# EAGLE board WiLoV2 (EAGLE 9.6.2)
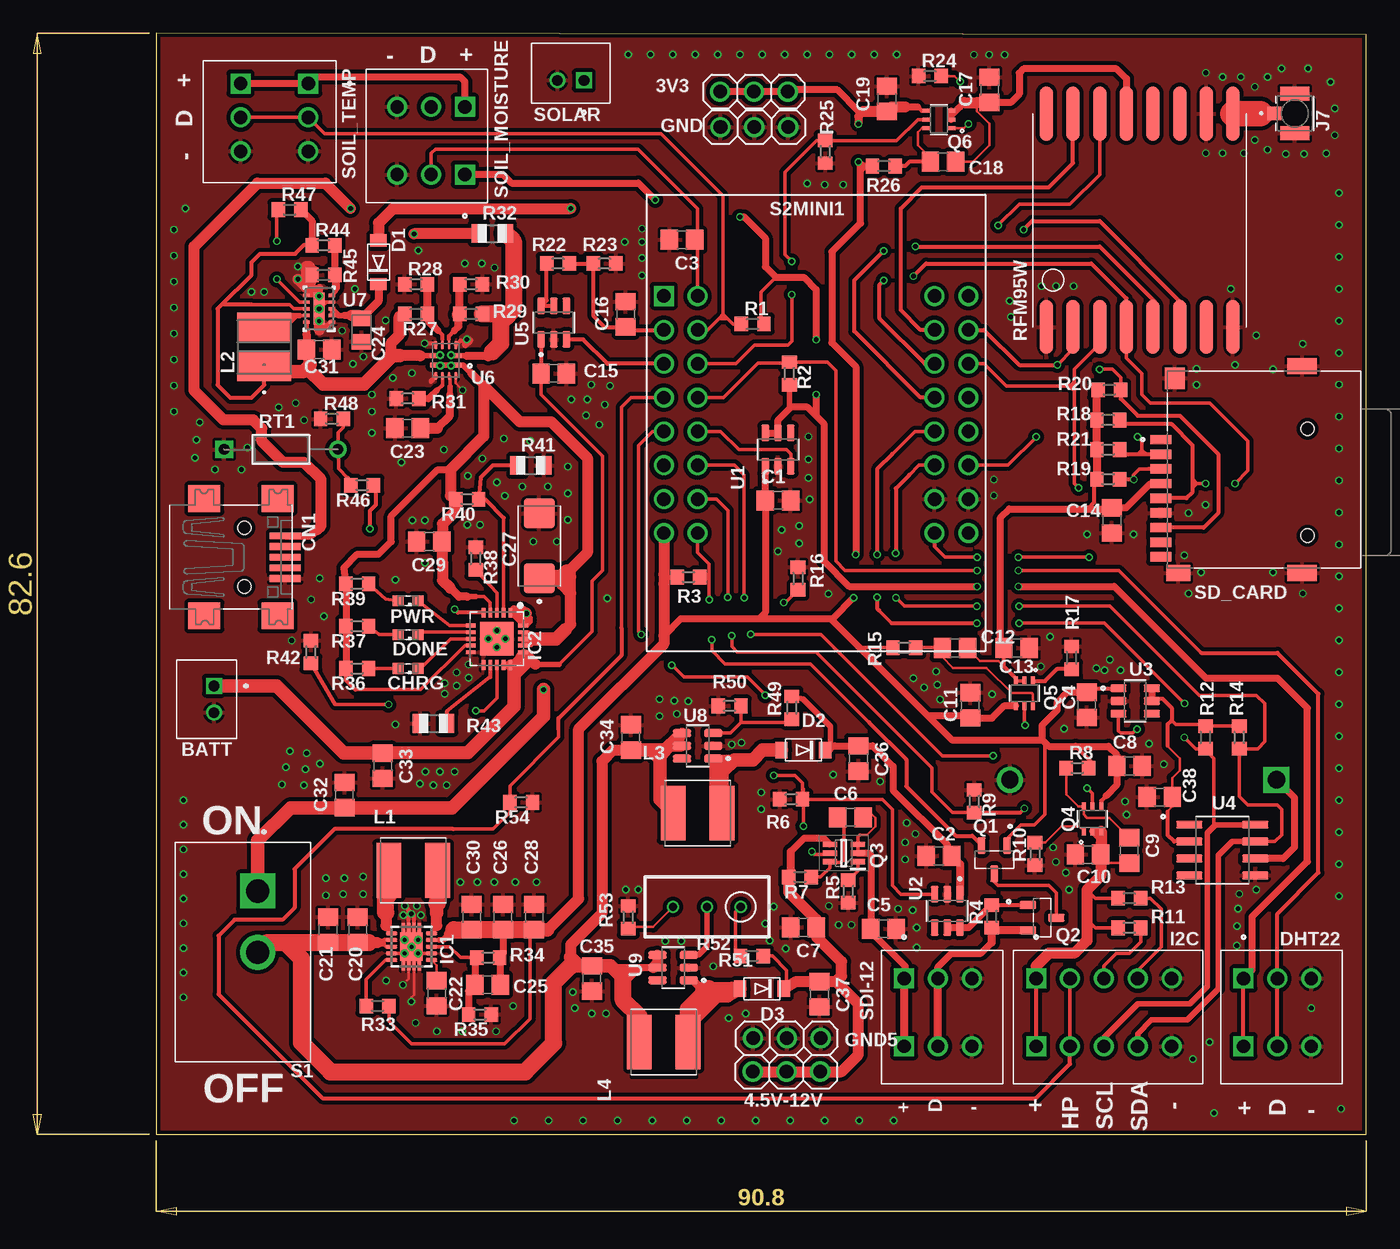
[diagram p3: board, top side]
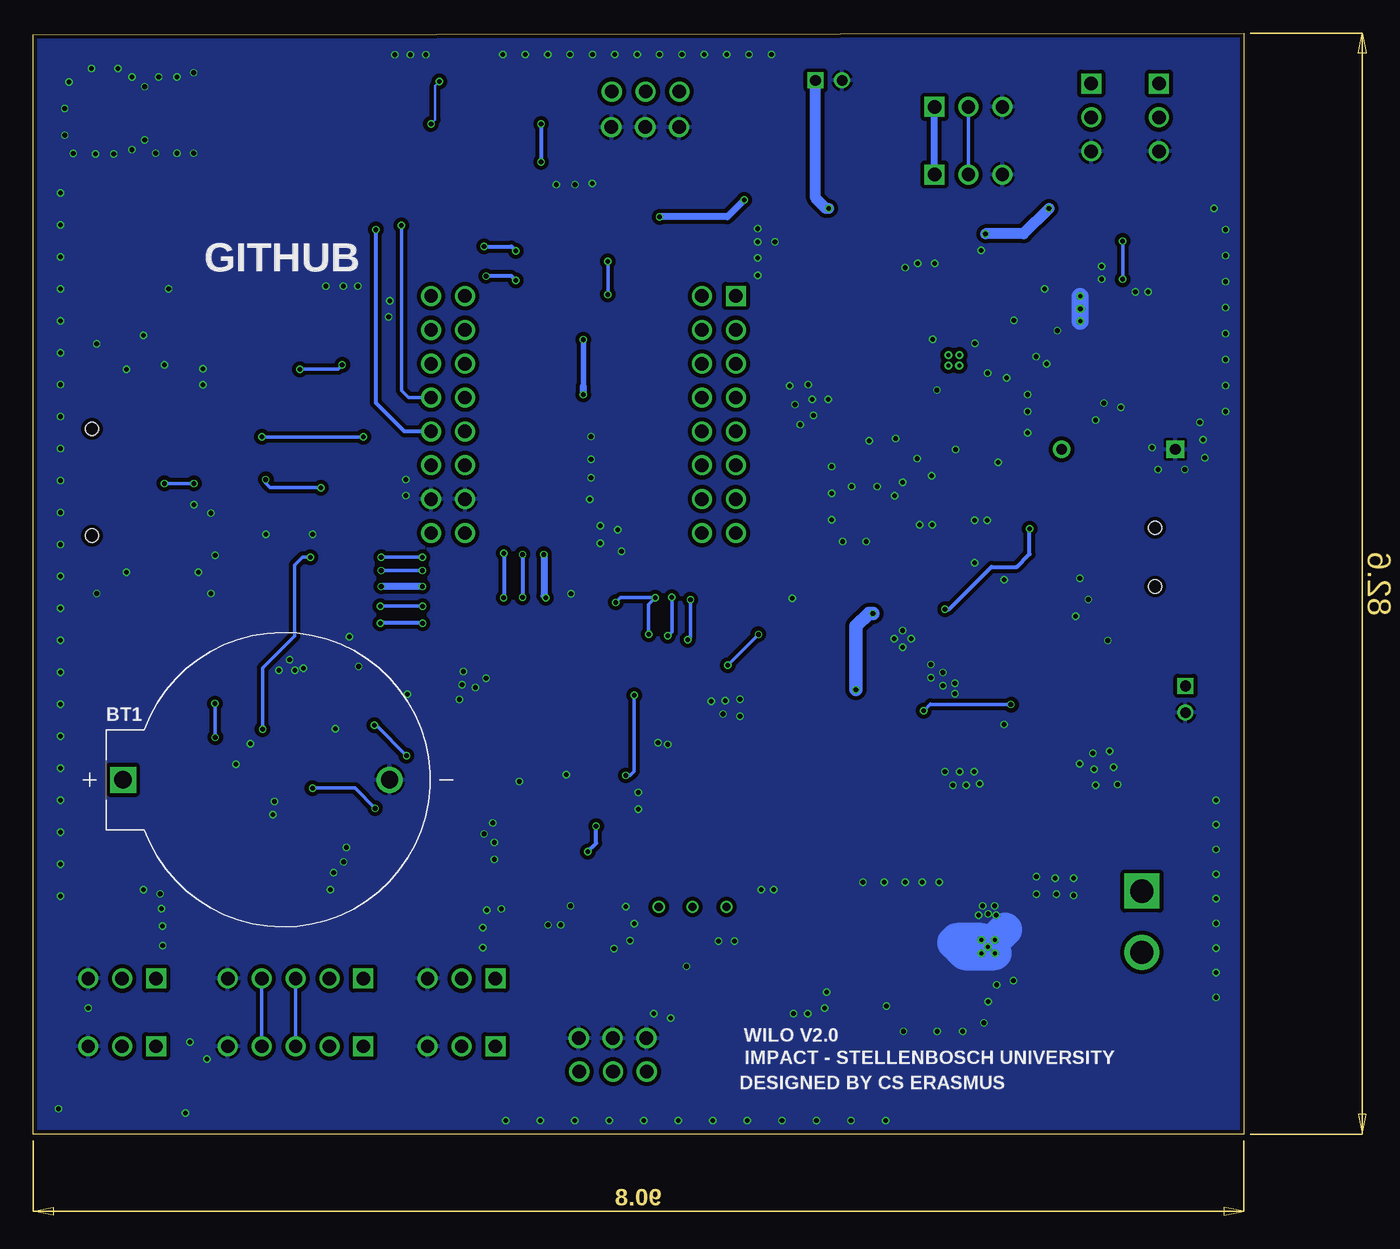
[diagram p4: board, bottom side, seen from below]

Size 90.8 x 82.6 mm. Coordinates in mm from the lower left corner, seen from the top.
Outline: 0,0 90.8,0 90.8,82.5 0,82.6 0,0
Copper layers (1*16): Top 0.035mm / dielectric 1.5mm / Bottom 0.035mm
Design rules "PCBWay_2L_152um-Track": minimum track width 6mil, minimum drill 0.3mm, track to track 6mil, track to pad 6mil, pad to pad 6mil, via to via 6mil, smd to smd 0mil, copper to edge 0.3mm, drill to drill 10mil, minimum pad ring 6mil, minimum via ring 0.1mm, stop-mask expansion 2mil, vias tented up to drill 0.45mm, thermal gap 0.2mm
Net classes: 0 default: width 0.203 mm; 1 vcc: width 0.254 mm; 2 Impedance: clearance 0.254 mm

## Footprints (pad centres in the part's own frame; a part is rotated, then mirrored left to right if it is on the bottom)
1X03 = drill 1.016: 1 -2.54,0; 2 0,0; 3 2.54,0
JST_B2B-PH-K-S = drill 0.8 square: 1 1,-0.55 | drill 0.8: 2 -1,-0.55
BAT_BH-25C-1 = drill 1.3: N -8,0 | drill 1.3 square: P 12,0
C0805 = smd 1.3 x 1.5: 1 -0.95,0; 2 0.95,0
CAPC2012X145N = smd 1.15 x 1.47: 1 -0.88,0; 2 0.88,0
CAPPM6032X280N = smd 2.24 x 2.32: 1 -2.435,0; 2 2.435,0
SML0603 = smd 0.8 x 0.8: A 0.75,0; C -0.75,0
USB-MINIB = smd 0.5 x 2.308: D+ 0,4.064; D- -0.8,4.064; GND 1.6,4.064; ID 0.8,4.064; VBUS -1.6,4.064 | smd 2 x 2.4: GND1 -4.4,-2; GND2 -4.4,3.5; GND3 4.4,3.5; GND4 4.4,-2 | hole 1: -2.2,1; 2.2,1
SOD-123FL = smd 0.91 x 1.22: A 1.637,0; C -1.637,0
CUI_TBL009V-254-03GY-2GY = drill 1 square: 1_A 0,0; 1_B 0,-5.08 | drill 1: 2_A 2.54,0; 2_B 2.54,-5.08; 3_A 5.08,0; 3_B 5.08,-5.08
CUI_TBL009V-254-05GY-2GY = drill 1 square: 1_A 0,0; 1_B 0,-5.08 | drill 1: 2_A 2.54,0; 2_B 2.54,-5.08; 3_A 5.08,0; 3_B 5.08,-5.08; 4_A 7.62,0; 4_B 7.62,-5.08; 5_A 10.16,0; 5_B 10.16,-5.08
DSC-S-PWSON-N10 = smd 0.28 x 0.85: 1 -1,-1.488; 2 -0.5,-1.488; 3 0,-1.488; 4 0.5,-1.488; 5 1,-1.488; 6 1,1.5; 7 0.5,1.5; 8 0,1.5; 9 -0.5,1.5; 10 -1,1.5 | smd 2.15 x 1.7: PP 0,0 | smd 3.55 x 0.25: PP@1 0,0.6; PP@2 0,0.2; PP@3 0,-0.2; PP@4 0,-0.6 | drill 0.3 pad 0.4: PP@5 -0.5,0.5; PP@7 0,0; PP@8 0.5,0.5; PP@9 -0.5,-0.5; PP@10 0.5,-0.5
QFN20_4MM = smd 0.73 x 0.28: P$1 -1.965,1; P$2 -1.965,0.5; P$3 -1.965,0; P$4 -1.965,-0.5; P$5 -1.965,-1; P$11 1.965,-1; P$12 1.965,-0.5; P$13 1.965,0; P$14 1.965,0.5; P$15 1.965,1 | smd 0.28 x 0.73: P$6 -1,-1.965; P$7 -0.5,-1.965; P$8 0,-1.965; P$9 0.5,-1.965; P$10 1,-1.965; P$16 1,1.965; P$17 0.5,1.965; P$18 0,1.965; P$19 -0.5,1.965; P$20 -1,1.965 | smd 2.5 x 2.5: P$21 0,0
HRS_U.FL-R-SMT(10) = smd 1.05 x 1: 1 -1.525,0 | smd 2.2 x 1.05: 2 0,1.475; 3 0,-1.475
IND_LQH5BPN1R0N38L = smd 1.85 x 4.1: 1 -1.825,0; 2 1.825,0
IND_IFSC_1515AH_VIS-M = smd 2.21 x 4.064: 1 -1.46,0; 2 1.46,0
IND_LQH5BPN6R8M38L = smd 1.85 x 4.1: 1 -1.825,0; 2 1.825,0
SOT95P240X111-3N = smd 1.23 x 0.6: 1 -1.06,0.95; 2 -1.06,-0.95; 3 1.06,0
SOT65P210X110-6N = smd 1.05 x 0.4: 1 -1.05,0.65; 2 -1.05,0; 3 -1.05,-0.65; 4 1.05,-0.65; 5 1.05,0; 6 1.05,0.65
TRANS_NTJD1155LT1G = smd 0.66 x 0.3: 1 -0.92,0.65; 2 -0.92,0; 3 -0.92,-0.65; 4 0.92,-0.65; 5 0.92,0; 6 0.92,0.65
R0603 = smd 1 x 1.1: 1 -0.85,0; 2 0.85,0
R0805 = smd 1.1 x 1.4: 1 -1,0; 2 1,0
RTRIM3296W = drill 0.61: 1 0,-2.54; 2 0,0; 3 0,2.54
HOPERF_RFM95W = smd 4.064 x 1.016: 1 -8.12,7.13; 2 -8.12,5.13; 3 -8.12,3.13; 4 -8.12,1.13; 5 -8.12,-0.87; 6 -8.12,-2.87; 7 -8.12,-4.87; 8 -8.12,-6.87; 9 7.88,-6.87; 10 7.88,-4.87; 11 7.88,-2.87; 12 7.88,-0.87; 13 7.88,1.13; 14 7.88,3.13; 15 7.88,5.13; 16 7.88,7.13
G1_USS = drill 0.813 pad 1.321 square: 1 0,0 | drill 0.813 pad 1.321: 2 8.534,0
SW_GF-123-0054 = drill 1.75 square: 1 -4.6,1.09 | drill 1.75: 2 0,1.09
S2MINI = drill 1: 1 3.81,-7.62; 2 3.81,-10.16; 3 1.27,-10.16; 3V3 1.27,-25.4; 4 3.81,-12.7; 5 1.27,-12.7; 6 3.81,-15.24; 7 1.27,-15.24; 8 3.81,-17.78; 9 1.27,-17.78; 10 3.81,-20.32; 11 1.27,-20.32; 12 1.27,-22.86; 13 3.81,-22.86; 14 3.81,-25.4; 15 21.59,-25.4; 16 24.13,-20.32; 17 21.59,-20.32; 18 24.13,-17.78; 21 21.59,-17.78; 33 24.13,-15.24; 34 21.59,-15.24; 35 24.13,-12.7; 36 21.59,-12.7; 37 24.13,-10.16; 38 21.59,-10.16; 39 24.13,-7.62; 40 21.59,-7.62; GND 21.59,-22.86; GND2 24.13,-22.86; VBUS 24.13,-25.4 | drill 1 square: EN 1.27,-7.62
CUI_MSD-4-A = smd 0.7 x 1.6: 1 2.25,7.75; 2 1.15,7.75; 3 0.05,7.75; 4 -1.05,7.75; 5 -2.15,7.75; 6 -3.25,7.75; 7 -4.35,7.75; 8 -5.45,7.75; CD -6.55,7.75 | smd 1.2 x 1.8: G1 -7.75,6.45 | smd 1.6 x 1.5: G2 6.85,6.7 | smd 1.2 x 2.2: G3 -7.75,-2.85; G4 7.75,-2.85 | hole 1: -4.95,-3.25; 3.05,-3.25
SOT95P280X145-6N = smd 1.21 x 0.58: 1 -1.255,0.95; 2 -1.255,0; 3 -1.255,-0.95; 4 1.255,-0.95; 5 1.255,0; 6 1.255,0.95
SOIC127P600X175-8N = smd 1.97 x 0.59: 1 -2.475,1.905; 2 -2.475,0.635; 3 -2.475,-0.635; 4 -2.475,-1.905; 5 2.475,-1.905; 6 2.475,-0.635; 7 2.475,0.635; 8 2.475,1.905
IC_TPS2121RUXR = smd 1.05 x 0.4: 1 -0.675,0.35; 2 -0.675,-0.35; 7 0.675,-0.35; 8 0.675,0.35 | drill 0.3 pad 0.406: 1_1 -0.402,0.384; 2_1 -0.402,-0.384; 7_1 0.41,-0.387; 8_1 0.404,0.38 | smd 0.2 x 0.6: 3 -0.75,-1.15; 4 -0.25,-1.15; 5 0.25,-1.15; 6 0.75,-1.15; 9 0.75,1.15; 10 0.25,1.15; 11 -0.25,1.15; 12 -0.75,1.15
DQC0010A = smd 0.5 x 0.25: 1 -0.95,1; 2 -0.95,0.5; 3 -0.95,0; 4 -0.95,-0.5; 5 -0.95,-1; 6 0.95,-1; 7 0.95,-0.5; 8 0.95,0; 9 0.95,0.5; 10 0.95,1 | smd 0.84 x 2.4: 11 0,0 | drill 0.3 pad 0.508: V 0,-0.94; V_2 0,0.94 | drill 0.35 pad 0.508: V_1 0,0
SOT95P280X145-6N' = smd 1.37 x 0.59: 1 -1.17,0.95; 2 -1.17,0; 3 -1.17,-0.95; 4 1.17,-0.95; 5 1.17,0; 6 1.17,0.95

## Placement (x,y rotation side)
3V3  [1X03]  44.86,78.23 0 top
4.5V-12V  [1X03]  47.31,4.69 180 top
BATT  B2B-PH-K-S  [JST_B2B-PH-K-S]  3.81,32.63 90 top
BT1  BH-25C-1  [BAT_BH-25C-1]  72.07,26.6 180 bottom
C1  1uF  [C0805]  46.67,47.55 0 top
C2  1uF  [C0805]  58.74,20.88 180 top
C3  100nF  [C0805]  39.47,67.11 180 top
C4  1uF  [C0805]  69.83,32.22 270 top
C5  1uF  [C0805]  54.58,15.42 0 top
C6  470pF  [C0805]  52.1,23.77 0 top
C7  10uF  [C0805]  48.58,15.52 180 top
C8  10uF  [C0805]  73.04,27.63 0 top
C9  470pF  [C0805]  73.02,21.29 270 top
C10  1uF  [C0805]  69.93,20.98 180 top
C11  10uF  [C0805]  61.1,32.18 90 top
C12  470pF  [C0805]  59.95,36.48 0 top
C13  1uF  [C0805]  64.57,36.48 0 top
C14  10uF  [C0805]  71.72,46.05 270 top
C15  1uF  [C0805]  29.84,57.08 0 top
C16  100nF  [C0805]  35.24,61.53 90 top
C17  1uF  [C0805]  62.55,78.35 90 top
C18  470pF  [C0805]  59.05,72.95 0 top
C19  10uF  [C0805]  54.84,77.68 90 top
C20  10uF  [C0805]  15.14,15.34 90 top
C21  10uF  [C0805]  12.92,15.34 90 top
C22  100nF  [C0805]  21.07,10.58 270 top
C23  100nF  [C0805]  18.88,52.98 180 top
C24  2.2uF  [CAPC2012X145N]  15.42,60.34 90 top
C25  10pF  [C0805]  24.88,11.21 180 top
C26  22uF  [C0805]  26.04,16.29 90 top
C27  TAJC475K025RNJ  [CAPPM6032X280N]  28.76,44.15 90 top
C28  22uF  [C0805]  28.38,16.29 90 top
C29  10uF  [C0805]  20.5,44.47 180 top
C30  22uF  [C0805]  23.7,16.29 90 top
C31  22uF  [C0805]  12.25,58.87 180 top
C32  10uF  [C0805]  14.14,25.44 90 top
C33  10uF  [C0805]  17.01,27.64 270 top
C34  22uF  [C0805]  35.62,29.77 90 top
C35  22uF  [C0805]  32.7,11.68 270 top
C36  22uF  [C0805]  52.7,28.19 270 top
C37  22uF  [C0805]  49.78,10.5 270 top
C38  100nF  [C0805]  75.3,25.3 180 top
CHRG  BLUE  [SML0603]  18.91,34.94 180 top
CN1  [USB-MINIB]  5.63,43.29 270 top
D1  MBR120VLSFT1G  [SOD-123FL]  16.69,65.42 90 top
D2  [SOD-123FL]  48.58,28.82 180 top
D3  [SOD-123FL]  45.47,10.92 180 top
DHT22  TBL009V-254-03GY-2GY  [CUI_TBL009V-254-03GY-2GY]  81.6,11.68 0 top
DONE  GREEN  [SML0603]  18.91,37.48 180 top
GND  [1X03]  44.89,75.56 0 top
GND5  [1X03]  47.34,7.2 180 top
I2C  TBL009V-254-05GY-2GY  [CUI_TBL009V-254-05GY-2GY]  66.04,11.68 0 top
IC1  TPS63060  [DSC-S-PWSON-N10]  19.17,14.07 270 top
IC2  MCP73871  [QFN20_4MM]  25.58,37.17 270 top
J7  U.FL-R-SMT(10)  [HRS_U.FL-R-SMT(10)]  85.44,76.6 0 top
L1  LQH5BPN1R0N38L  [IND_LQH5BPN1R0N38L]  19.3,19.8 0 top
L2  10uH  [IND_IFSC_1515AH_VIS-M]  8.12,59.07 90 top
L3  LQH5BPN6R8M38L  [IND_LQH5BPN6R8M38L]  40.64,24.09 0 top
L4  LQH5BPN6R8M38L  [IND_LQH5BPN6R8M38L]  38.1,6.92 0 top
PWR  RED  [SML0603]  18.91,40.02 180 top
Q1  2N7002  [SOT95P240X111-3N]  62.9,20.6 270 top
Q2  2N7002  [SOT95P240X111-3N]  66.48,16.25 0 top
Q3  SI1865DDL-T1-GE3  [SOT65P210X110-6N]  51.6,21.1 180 top
Q4  NTJD1155LT1G  [TRANS_NTJD1155LT1G]  70.26,23.66 90 top
Q5  NTJD1155LT1G  [TRANS_NTJD1155LT1G]  65.16,33.08 270 top
Q6  NTJD1155LT1G  [TRANS_NTJD1155LT1G]  58.74,76.13 180 top
QR_CODE  QR_CODE  [QR_CODE]  77,67.7 0 bottom
R1  10k  [R0603]  44.77,60.8 0 top
R2  4.7k  [R0603]  47.53,57.08 270 top
R3  10k  [R0603]  39.96,41.8 180 top
R4  10k  [R0603]  62.71,16.34 90 top
R5  2k  [R0603]  51.94,18.22 90 top
R6  100k  [R0603]  47.66,25.13 0 top
R7  100k  [R0603]  48.32,19.3 180 top
R8  100k  [R0603]  69.13,27.47 0 top
R9  100k  [R0603]  61.4,24.98 270 top
R10  2k  [R0603]  65.94,21.04 90 top
R11  4.7k  [R0603]  73.03,15.49 180 top
R12  4.7k  [R0603]  78.74,29.77 90 top
R13  4.7k  [R0603]  73.03,17.71 180 top
R14  4.7k  [R0603]  81.28,29.77 90 top
R15  100k  [R0603]  56.14,36.51 180 top
R16  100k  [R0603]  48.17,41.69 270 top
R17  2k  [R0603]  68.7,35.75 270 top
R18  10k  [R0603]  71.44,53.59 180 top
R19  10k  [R0603]  71.44,49.14 180 top
R20  10k  [R0603]  71.53,55.85 180 top
R21  10k  [R0603]  71.44,51.37 180 top
R22  51k  [R0603]  30.16,65.34 180 top
R23  75k  [R0603]  33.66,65.34 180 top
R24  2k  [R0603]  58.06,79.39 0 top
R25  100k  [R0603]  50.22,73.7 90 top
R26  100k  [R0603]  54.61,72.64 180 top
R27  23.7k  [R0603]  19.52,61.55 180 top
R28  5k  [R0603]  19.52,63.77 0 top
R29  23.7k  [R0603]  23.65,61.55 0 top
R30  5k  [R0603]  23.65,63.77 180 top
R31  51.1k  [R0603]  18.88,55.2 0 top
R32  0 ohm  [R0805]  25.23,67.58 0 top
R33  100k  [R0603]  16.63,9.62 0 top
R34  287k  [R0603]  24.93,13.25 0 top
R35  51.1k  [R0603]  24.3,8.98 180 top
R36  5.1k  [R0603]  15.11,34.94 180 top
R37  5.1k  [R0603]  15.11,38.12 180 top
R38  10k  [R0603]  24,43.2 270 top
R39  4.53k  [R0603]  15.11,41.29 180 top
R40  270K  [R0603]  23.36,47.64 180 top
R41  100K  [R0805]  28.12,50.18 0 top
R42  2k  [R0603]  11.63,36.19 270 top
R43  100K  [R0805]  20.82,30.81 0 top
R44  105k  [R0603]  12.56,66.69 0 top
R45  20k  [R0603]  12.56,64.47 0 top
R46  1K  [R0603]  15.47,48.69 180 top
R47  100k  [R0603]  10.03,69.37 0 top
R48  150k  [R0603]  13.2,53.68 0 top
R49  117k  [R0603]  47.7,32 90 top
R50  16k  [R0603]  43.04,32.13 0 top
R51  104k  [R0603]  44.7,13.37 0 top
R52  10k  [RTRIM3296W]  41.34,17.05 90 top
R53  6.04k  [R0603]  35.43,16.28 270 top
R54  10k  [R0603]  27.4,24.9 180 top
RFM95W  HOPERF_RFM95W  [HOPERF_RFM95W]  73.94,68.69 90 top
RT1  10K  [G1_USS]  5.12,51.39 0 top
S1  GF-123-0054  [SW_GF-123-0054]  6.54,13.65 270 top
S2MINI1  S2MINI  [S2MINI]  36.83,70.51 0 top
SD_CARD  MSD-4-A  [CUI_MSD-4-A]  83.14,49.87 90 top
SDI-12  TBL009V-254-03GY-2GY  [CUI_TBL009V-254-03GY-2GY]  56.13,11.68 0 top
SOIL_MOISTURE  TBL009V-254-03GY-2GY  [CUI_TBL009V-254-03GY-2GY]  23.18,72 180 top
SOIL_TEMP  TBL009V-254-03GY-2GY  [CUI_TBL009V-254-03GY-2GY]  11.43,78.83 270 top
SOLAR  B2B-PH-K-S  [JST_B2B-PH-K-S]  31.11,79.62 0 top
U1  TPS22917DBVR  [SOT95P280X145-6N]  46.67,51.37 90 top
U2  TPS22917DBVR  [SOT95P280X145-6N]  59.37,16.76 270 top
U3  TPS22917DBVR  [SOT95P280X145-6N]  73.47,32.51 0 top
U4  DS3231MZ+TRL  [SOIC127P600X175-8N]  80.01,21.32 0 top
U5  TPS22917DBVR  [SOT95P280X145-6N]  29.84,60.89 90 top
U6  TPS2121RUXR  [IC_TPS2121RUXR]  21.74,58.06 180 top
U7  TPS62175DQCR  [DQC0010A]  12.25,61.93 180 top
U8  MT3608  [SOT95P280X145-6N']  40.64,29.14 180 top
U9  MT3608  [SOT95P280X145-6N']  38.8,12.5 180 top

## Tracks (layer width: path | path; a pad name or v marks a point on that pad's centre or on a via)
3V3_DHT22_SM  (via drill 0.35)
  Top 0.254: 46.5,64.3 45.4,63.2 45.4,61.01 R1.2
  Top 0.305: DHT22.1_B DHT22.1_A
  Top 0.406: R2.2 47.53,54.64 47.62,54.54
  Top 0.508: U1.6 U1.5 46.67,53.59 47.62,54.54 48.9,54.54 49.37,54.06 | DHT22.1_A 82.23,12.31 82.23,16.31 86.38,20.46 86.38,31.98 84.14,34.22 78.78,34.22 71.9,41.1 v64.7,41.1 | v49.53,55.49 49.53,54.06 49.37,54.06 | v37.47,70.1 36.2,71.37 26.67,71.37 26.04,72 SOIL_MOISTURE.1_A | SOIL_MOISTURE.1_B 23.18,78.99 22.86,79.31 11.91,79.31 SOIL_TEMP.1_A SOIL_TEMP.1_B | v43.81,68.83 44.13,68.83 45.72,67.24 45.72,65.08 46.5,64.3 48.6,64.3 49.53,63.37 v49.53,59.62 | 49.37,54.06 50.1,53.34 50.1,43 52,41.1 v61.6,41.1
  Bottom 0.406: v49.53,59.62 49.53,56.13
  Bottom 0.508: v49.53,55.49 49.53,56.13 | SOIL_MOISTURE.1_A SOIL_MOISTURE.1_B | v43.81,68.83 38.73,68.83 v37.47,70.1 | v61.6,41.1 v64.7,41.1
3V3_I2C_PORT
  Top 0.203: C9.2 71.52,20.34 71.48,20.38 C10.1
  Top 0.254: 69.85,18.34 70.48,17.71 R13.2 | 69.85,16.12 70.48,15.49 R11.2
  Top 0.305: I2C.1_B I2C.1_A
  Top 0.508: Q4.3 Q4.2 70.91,22.09 70.91,21.84
  Top 0.813: Q4.3 70.91,21.84 70.91,21.01 C10.1 70.88,19.38 69.85,18.34 69.85,16.12 69.85,14.54 68.9,13.58 66.99,13.58 66.04,12.63 I2C.1_A
5V_SDI12
  Top 0.305: R4.2 Q2.1
  Top 0.508: U2.5 U2.6 60.98,15.5 62.67,17.2 R4.2
+3V3  (via drill 0.35)
  Top 0.203: R8.2 70.2,27.7
  Top 0.254: C28.1 28.06,15.02 28.06,8.67 26.15,6.77 19.17,6.77 17.48,8.46 R33.2 | 63.85,22.15 64.89,23.2 65.9,23.2 66.7,24 66.7,29.2 66.3,29.6 | 38.1,41.3 38.6,41.8 R3.2 38.3,41.8 38.1,42 | R15.2 53.01,36.51 52.9,36.4
  Top 0.305: IC1.9 21.25,14.57 | Q6.4 57.45,76.78 57.15,77.08 | 53.02,72.64 52.86,72.8 | 63.85,22.15 Q1.1 | C4.1 70.12,33.46 U3.1 | Q4.4 70.91,25.01 71.3,25.4 | 69,29.11 70.2,27.91 70.2,27.7
  Top 0.406: 21.25,14.57 21.57,14.57 21.71,14.71
  Top 0.508: 21.71,14.71 22.02,15.02 | C26.1 26.04,13.51 R34.2 25.83,13.2 C25.1 | 56.2,77.08 57.15,77.08 | C4.1 68.39,33.16 67.63,32.4 67.63,31.83 66.5,30.7 66.5,29.6 | U1.1 C1.1 45.72,39.14 45.25,38.67 | 50.75,38.67 45.25,38.67 | 45.25,38.67 39.37,38.67 38.1,37.4 | v52.34,40.25 50.75,38.67 | 52.86,72.32 52.86,68.35 50.72,66.2 50.72,59.39 52.5,57.6 v52.5,43.5 | 52.86,72.32 52.86,72.8 v52.7,72.95 | R26.2 53.18,72.64 | 53.18,72.64 53.02,72.64 | 52.86,72.32 53.18,72.64 | 53.06,76.73 52.74,76.73 51.12,78.35 47.53,78.35 3V3.3 3V3.2 3V3.1 | 71.3,25.4 72.09,26.19 C8.1 72.09,28.49 71.47,29.11 69,29.11 66.99,29.11 66.5,29.6 | 50.75,38.67 50.75,38.55 52.9,36.4 57.93,31.37 | 57.93,31.37 60.83,31.37 C11.1 62.73,31.23 63.66,32.16 Q5.4 | 57.93,31.37 59.7,29.6 66.3,29.6 66.5,29.6
  Top 0.61: 53.06,76.73 52.7,76.37 v52.7,75.81
  Top 0.813: 22.02,15.02 22.34,15.34 | 56.2,77.08 55.2,77.08 C19.1 53.06,76.73 | S2MINI1.3V3 38.1,42 38.1,41.3 38.1,37.4 38.1,36.8 31.71,30.41 31.71,17.68 29.38,15.34
  Top 1.016: C28.1 29.38,15.34
  Top 1.27: C28.1 C26.1 C30.1 22.34,15.34
  Bottom 0.305: v52.7,75.81 v52.7,72.95
  Bottom 0.508: v52.5,43.5 52.5,40.41 v52.34,40.25
+5V
  Top 0.406: R49.2 48.56,32.65 50.6,30.61 50.6,28.85 D2.C
  Top 0.508: 59.37,21.2 59.37,21.73 55.3,25.8 55.3,27.6 53.76,29.14 C36.1 50.94,29.14 D2.C
  Top 0.61: 59.37,21.2 C2.1 60.32,20.25 U2.1
+12V
  Top 0.254: D3.C 47.31,11.12 47.31,12.31 46.25,13.37 R51.2
  Top 0.508: 47.62,21.2 48.62,22.2 50.1,22.2 Q3.4
  Top 0.61: 47.62,21.2 47.62,19.45 R7.2
  Top 0.813: R7.2 47.47,18.18 49.53,16.12 C7.1 49.53,14.85 51.44,12.95 51.44,11.86 51.02,11.45 | D3.C 48.05,11.45 C37.1 51.02,11.45 | 51.02,11.45 52.7,9.77 52.7,5.96 51.44,4.69 4.5V-12V.1 4.5V-12V.2 4.5V-12V.3
AT_RH_ST_SM_PWR_EN
  Top 0.254: U1.3 47.62,51.05 47.31,51.37 43.73,51.37 42.37,52.73 S2MINI1.8
BATT
  Top 0.254: 30.25,35.26 32.7,37.71 32.7,41.52 33.49,42.31 33.49,50.9 28.89,55.49 C15.1
  Top 0.305: 27.95,35.26 27.95,35.76 | U5.1 C15.1
  Top 0.406: 26.99,35.2 27.11,35.2 27.33,35.42 | 27.33,35.42 27.55,35.64 | IC2.P$14 IC2.P$15 26.8,35.42 27.33,35.42 | 28.45,35.26 30.25,35.26 | 27.49,35.26 27.49,35.81 27.55,35.87 IC2.P$16
  Top 0.508: 27.95,35.26 27.49,35.26 27.33,35.42 | 27.55,35.64 27.57,35.64 27.95,35.26 | 27.95,35.26 26.93,34.24 26.85,34.24
  Top 0.813: 26.99,35.2 26.99,35.28 27.39,35.68 27.39,35.8 27.55,35.95 27.76,35.95 27.95,35.76 28.45,35.26 | 27.49,35.26 27.43,35.2 IC2.P$15
  Top 1.016: 27.11,35.2 26.85,34.94 26.85,34.24 26.85,32.09 23.41,28.64 C33.1 14.1,28.59 9.05,33.63 BATT.1
BATT_ADC
  Top 0.305: R22.1 R23.2 32.8,61.42 33.65,60.58 C16.1 35.47,60.35 S2MINI1.3
BATT_LVL_ADC_EN
  Top 0.305: S2MINI1.5 33.88,57.81 32.05,59.64 U5.3
CUTOUT_INDUCTOR
  cutout Top: 17.58,22.01 20.44,22.01 20.44,17.88 17.9,17.88 17.9,22.01
  cutout Top: 35.68,11.11 40.54,11.11 40.54,4.28 35.68,4.28
  cutout Top: 38.18,28.01 43.24,28.01 43.24,21.58 38.18,21.58
DHT22_DATA  (via drill 0.35)
  Top 0.254: v61.6,42.3 51.7,42.3 51,43 51,57.3 50.37,57.93 R2.1 47.45,57.85 45.15,57.85 42.57,55.27 S2MINI1.6 | 78.42,36.12 72.25,42.3 v64.7,42.3
  Top 0.305: 78.42,36.12 84.14,36.12 87.22,33.05 87.22,19.63 84.14,16.55 DHT22.2_A DHT22.2_B
  Bottom 0.254: v61.6,42.3 v64.7,42.3
GND  (via drill 0.35, 0.35 pad 0.55)
  Top 0.203: U6.12 22.49,56.35 v23.01,55.83 | IC1.PP@3 18.97,11.65 18.85,11.53 | IC1.PP@2 19.37,10.46 19.17,10.26
  Top 0.254: U7.4 12.75,62.43 12.66,62.34 | IC2.P$21 v26.22,37.17 | IC1.7 IC1.PP@8 | IC1.4 IC1.PP@10
  Top 0.305: 11.61,62.93 12.2,62.93 12.25,62.88 | 11.61,62.93 12.2,63.52 | 12.2,63.52 12.25,63.52 | 11.61,62.93 11.61,63.2 | 11.61,63.2 11.61,63.52 11.61,63.96 | 12.2,63.52 11.93,63.52 11.61,63.2 | U7.6 11.57,63.2 11.61,63.2 | U7.1 13.19,60.92 | U7.V_1 12.66,62.34 | U6.3 22.84,59.56 23.24,59.56 23.56,59.56 | U6.6 20.99,59.31 20.97,59.33 v20.15,59.33 | IC1.PP@2 19.37,16.43 v18.67,17.13 18.97,16.83 IC1.PP@3 | U6.9 20.99,56.8 20.64,56.45 20.64,56.55 U6.9
  Top 0.406: U7.1 12.93,60.66 12.25,60.66
  Top 0.508: 23.21,59.21 23.56,59.56 | 23.24,59.56 v23.33,59.64 | IC2.P$21 v24.95,37.17 | IC2.P$21 v25.58,36.53 | IC2.P$21 v25.58,37.8
  Top 0.61: U7.V_1 12.25,62.88 12.25,63.52
  Top 0.813: R45.1 11.55,65.04 | R45.1 11.48,65.11 11.29,65.11 | 11.29,64.47 R45.1 | R45.1 11.8,64.79 11.29,64.79 | 11.61,63.96 R45.1 | U7.V_1 | U7.V_1 U7.V | U7.V_1 12.25,60.66 12.25,60.34 | 11.61,63.52 11.29,63.52 v10.66,64.15
  Bottom 1.27: U7.V_2 U7.V_1 U7.V
  Bottom 2.54: IC1.PP@5 21.52,14.57 21.71,14.39 20.89,13.57 IC1.PP@10 | IC1.PP@9 17.9,15.34
  other vias: 9.45,26.24 19.2,57.1 10.66,65.11 20.21,27.19 25.58,48.91 27.49,48.6 29.39,48.6 28.09,52.02 28.3,44.47 30.07,44.47 23.36,45.74 24.31,45.74 19.23,46.05 20.18,46.05 20.18,42.88 7.17,63.2 8.12,63.2 26.97,18.92 28.56,18.92 24.11,18.92 25.38,18.92 22.84,18.92 82.44,74.6 86.13,73.55 84.76,73.55 83.4,73.87 84.44,79.96 86.44,79.96 82.44,78.6 83.4,79.33 81.4,79.33 78.76,79.64 87.81,73.6 88.44,74.96 88.44,76.96 88.13,78.96 4.41,49.88 6.41,49.88 3.05,52.11 2.91,50.74 3.28,53.42 6.87,51.52 30.89,46.1 30.89,48.1 30.89,50.1 19.7,66.31 17.23,61.06 10.18,37.05 12.6,38.85 17.95,30.74 23.45,35.24 23.45,34.24 43.2,29.24 67.31,21.52 68.51,18.35 67.52,20.43 68.26,19.61 73.34,45.02 77.47,46.6 78.74,47.24 83.82,57.4 80.64,63.43 82.55,59.94 80.96,57.72 56.83,34.22 17.26,11.53 18.53,11.21 19.17,9.94 19.48,8.36 21.07,7.72 22.98,7.72 25.52,7.72 82.55,18.36 81.28,18.03 81.1,15.61 81.1,14.15 79.38,1.59 88.9,1.9 86.68,9.46 79.06,6.92 77.79,5.65 66.39,35.1 67.09,37.33 71.17,34.81 70.55,34.96 74.52,29.31 46.67,43.75 48.26,45.65 15.56,58.35 14.92,63.43 23.18,65.34 24.45,65.34 25.4,65.02 17.78,56.76 11.11,53.59 14.77,57.79 10.48,54.86 9.21,54.54 21.59,51.37 2.22,69.46 1.35,67.87 1.35,65.92 1.35,63.97 1.35,62.02 1.35,60.07 1.35,58.12 1.35,56.17 1.35,54.22 11.64,40.12 12.28,41.71 17.96,41.61 26.79,9.62 31.43,9.46 31.27,10.67 32.71,9.06 33.77,9.04 42.98,8.72 44.25,9.04 52.19,15.71 51.23,15.71 50.5,17.13 56.21,20.62 56.21,21.89 56.98,22.53 56.33,23.36 50.81,26.97 54.33,26.47 69.85,45.02 77.15,43.43 78.42,42.16 77.47,40.57 88.77,46.65 86.04,40.57 83.82,42.16 88.77,61.03 86.04,59.3 80.03,79.33 78.76,73.61 80.03,73.61 81.62,73.61 35.24,18.34 36.2,18.34 46.35,17.07 45.72,15.8 46.04,14.54 39.93,32.5 39.06,31.53 38.89,32.53 37.78,31.36 37.78,32.63 43.93,29.38 45.4,25.65 45.4,24.38 16.19,55.49 16.19,54.22 16.19,52.64 18.41,50.41 75.61,27.77 72.71,24.97 72.81,23.97 56.79,16.81 55.69,16.91 57.09,15.51 57.09,14.01 47.24,13.93 61.36,81 63.66,81 62.51,81 55.56,81 53.88,81 52.21,81 51.56,71.25 50.16,71.25 48.86,71.34 36.46,67.95 36.46,66.95 36.46,65.75 35.16,66.95 36.46,64.44 31.16,55.15 32.36,55.15 32.66,56.25 34.06,56.15 33.66,54.75 33.26,53.25 32.26,53.95 26.18,47.91 26.09,52.2 24.49,50.7 23.39,49.4 22.55,34.64 22.55,33.64 21.65,33.84 21.65,33.04 33.86,40.22 15.54,18.02 14.04,18.02 12.74,17.92 12.74,19.22 14.14,19.22 15.54,19.32 81.18,16.93 88.77,39.45 68.84,63.63 64.14,61.33 64.05,62.53 67.55,63.63 66.44,63.63 78.06,56.22 78.06,57.42 62.86,47.92 62.86,49.12 38.2,14.5 39.4,14.5 41.8,12.6 19.81,26.29 20.81,26.19 21.31,27.19 21.81,26.19 22.41,27.19 12.31,27.79 11.31,28.59 11.21,27.39 11.11,26.19 10.05,28.74 9.75,27.54 58.63,33.72 58.53,34.72 62.73,33.02 58.83,32.62 57.63,33.52 48.96,52.35 48.96,50.65 48.96,49.25 49.06,47.65 48.26,44.35 46.96,45.35 50.46,40.55 72.37,34.81 71.57,35.61 68.13,30.42 19.57,17.13 19.17,16.53 18.57,16.43 19.87,16.43 2.06,25.07 2.06,23.22 2.06,21.38 2.06,19.52 2.06,17.68 2.06,15.82 2.06,13.97 2.06,12.12 2.06,10.27 26.86,1.02 29.45,1.02 32.04,1.02 34.64,1.02 37.23,1.02 39.82,1.02 42.41,1.02 45,1.02 47.59,1.02 50.18,1.02 52.77,1.02 55.36,1.02 88.77,41.85 88.77,44.25 88.77,49.05 88.77,51.44 88.77,53.84 88.77,56.24 88.77,58.64 88.77,63.43 88.77,65.83 88.77,68.23 88.77,70.62 88.77,37.06 88.77,34.66 88.77,32.26 88.77,29.86 88.77,27.47 88.77,25.07 88.77,22.67 88.77,20.27 88.77,17.88 35.42,81 37.1,81 38.78,81 40.46,81 42.14,81 43.82,81 45.49,81 47.17,81 48.85,81 50.53,81 13.96,60.29
  pour Top (isolate 0.305): 0,82.48 90.81,82.48 90.81,0 0,0
  pour Bottom (isolate 0.305): 0.03,82.48 90.81,82.48 90.81,0.01 0,0
HEAT_PULSE
  Top 0.254: I2C.2_B I2C.2_A | S2MINI1.7 35.66,55.27 34.92,54.54 34.92,38 | 22.3,22.9 25.3,22.9 26.55,24.15 R54.2 26.55,26.15 30.2,29.8 30.2,30.4
  Top 0.305: 34.92,38 34.92,35.93 30.2,31.2 30.2,30.4 | 22.3,22.9 13.4,22.9 10.4,19.9 10.4,17 9.5,16.1 5.9,16.1 4.7,14.9 4.7,10.5 12.5,2.7 66,2.7 68.58,5.28 I2C.2_B
I2C_PORT_PWR_EN  (via drill 0.35)
  Top 0.254: Q4.5 70.26,25.55 v69.85,25.96 | v43.2,37.4 43.2,36.6 43.6,36.2 49.5,36.2 58.2,27.5 58.2,25.7 59.77,24.13 R9.2 | 64.84,24.13 v65.16,24.45 | v42.9,40.3 42.9,46.8 42.05,47.65 S2MINI1.13
  Top 0.305: R9.2 64.84,24.13
  Bottom 0.254: v65.16,24.45 66.67,25.96 v69.85,25.96 | v42.9,40.3 42.9,37.7 v43.2,37.4
MISO  (via drill 0.35)
  Top 0.254: v67.63,57.72 68.81,58.9 RFM95W.2 | v70.8,57.4 71.75,57.4 72.39,56.76 72.39,55.21 72.38,55.19
  Top 0.305: R20.1 72.38,55.19 73.66,53.91 76.83,53.91 79.69,51.05 79.69,46.6 78.61,45.52 SD_CARD.7 | S2MINI1.37 62.13,60.35 64.77,57.72 v67.63,57.72
  Bottom 0.254: v70.8,57.4 67.94,57.4 v67.63,57.72
MOSI  (via drill 0.35, 0.35 pad 0.55)
  Top 0.254: RFM95W.3 70.81,59.31 68.9,57.4 68.9,56.45 68.9,55.81 68.9,48.83 v69.22,48.51 | v73.36,49.12 73.34,49.14 73.34,49.46 73.8,49.92 74.47,49.92 | 68.58,56.13 63.82,56.13 62.13,57.81 S2MINI1.35
  Top 0.305: R19.1 73.34,49.14 | SD_CARD.3 74.47,49.92 | 68.9,55.81 68.58,56.13 68.9,56.45
  Bottom 0.254: v73.36,49.12 73.36,48.85 73.03,48.51 v69.22,48.51
N$1
  Top 0.254: Q2.3 67.54,18.11 66.99,18.66 63.18,18.66 62.9,18.95 Q1.3
N$2
  Top 0.254: R7.1 49.85,19.3 50.55,20 50.55,20.4 | 50.55,20.4 Q3.6 | C6.1 51.6,23.33 51.6,20.6 51.4,20.4 50.55,20.4
N$3
  Top 0.305: U5.5 U5.6 29.31,62.56 R22.2
N$4
  Top 0.254: Q3.1 52.65,19.77 R5.2
N$5
  Top 0.203: C9.1 71.52,23.74 69.85,23.74 69.61,23.98 Q4.6 69.22,24.58 68.3,25.5 68.3,27.45 R8.1
N$6
  Top 0.254: R51.1 43.5,13.93 43.5,16.67 R52.1
N$7
  Top 0.203: R10.2 66.72,21.88 67.94,23.11 69.25,23.11 Q4.1
N$8
  Top 0.203: 52.8,22.47 53.34,22.47 53.98,23.11 53.98,23.74 53.66,24.06 53.34,24.06 C6.2
  Top 0.254: 52.8,22.47 52.65,22.32 Q3.3 Q3.2
  Top 0.508: SDI-12.1_A 56.2,11.74 56.2,12.63 53.66,15.17 53.66,15.39 C5.1 53.66,15.45 53.66,20.88 53.44,21.1 Q3.2
  Top 0.61: SDI-12.1_A SDI-12.1_B
N$9
  Top 0.61: U9.1 40.3,11.55 40.7,11.15 | 40.7,11.15 43.18,11.15 D3.A | 40.98,10.88 40.7,11.15
  Top 1.016: 40.98,10.88 41.42,10.88 | 41.42,10.88 41.91,10.39 42.9,10.39 D3.A 41.47,10.91 41.42,10.88
  Top 1.27: 39.92,8.41 41.91,10.39 | L4.2 39.92,8.41 | 41.47,10.91 39.92,9.37 39.92,8.41
N$10
  Top 0.406: R52.2 41.34,14.09 40.7,13.45 U9.3
N$11
  Top 0.203: R52.3 37.3,15.55 35.51,15.55 R53.2
N$12
  Top 0.508: BT1.P 85.41,25.27 85.41,21.52 84.57,20.68 U4.6
N$14
  Top 0.203: 75.88,29.14 75.88,29.12 76.8,28.2 76.8,27.3 76.25,26.75 C38.1 76.25,24.58 75.88,24.21
  Top 0.254: 76.2,31.04 76.52,30.73 78.64,30.73 R12.2 R14.2
  Top 0.305: U3.5 74.88,32.66 75.53,32.66 76.2,32 76.2,31.04 75.88,30.73 75.88,29.14 | U4.2 76.4,21.95 75.88,22.47 75.88,24.21
  Top 0.508: U3.6 U3.5
N$15
  Top 0.203: C12.1 59.01,36.4 59.01,35.8 59.8,35 62.3,35 64.2,33.1 65.7,33.1 65.81,32.99 Q5.6
  Top 0.254: R15.1 58.9,36.51 59.01,36.4
N$16
  Top 0.305: IC1.1 17.26,15.49 17.26,15.66
  Top 0.813: 17.26,16.61 17.26,15.66
  Top 1.27: 17.26,16.61 17.2,16.67 17.2,17.7 17.48,17.97 L1.1
N$17
  Top 0.305: R17.2 67.61,34.9 66.71,34 Q5.1
N$18
  Top 0.61: U8.1 43.31,28.19 43.4,28.1 | 42.47,27.16 42.47,27.54 U8.1 | U8.1 41.81,24.75 L3.2
  Top 1.016: L3.2 42.47,27.16 43.4,28.1 44.8,28.1 45.52,28.82 D2.A
N$20
  Top 0.508: 82.84,76.57 83.89,76.57 J7.1
  Top 1.928: 82.84,76.57 RFM95W.9
N$21
  Top 0.305: IC1.10 21.07,15.47 21.07,15.66
  Top 0.813: 21.07,15.66 21.07,16.61
  Top 1.016: 21.07,17.3 21.07,16.61
  Top 1.27: L1.2 21.12,17.35 21.07,17.3
N$24
  Top 0.508: SDI-12.2_A 58.67,12.57 59.69,13.58 61.91,13.58 62.71,14.38
  Top 0.61: SDI-12.2_B SDI-12.2_A | 62.71,14.38 R4.1 62.9,15.3 Q2.2
N$25
  Top 0.203: IC1.6 21.07,12.66 C22.1
N$26
  Top 0.254: U8.3 43.09,30.09 43.89,30.89 | 43.89,30.89 R50.2 | R49.1 47.45,30.9 43.9,30.9 43.89,30.89
N$27
  Top 0.203: C12.2 60.92,36.4 61.82,35.5 63.2,35.5 63.62,35.08
  Top 0.254: Q5.3 Q5.2
  Top 0.305: Q5.3 64.51,34.19 63.62,35.08 C13.1 | 69.9,46.92 70.4,47.42 70.4,48.96 R19.2
  Top 0.508: 71.63,46.92 69.9,46.92 64.02,46.92 63.32,46.22 63.32,36.79 C13.1 | C14.1 72.81,47.01 74.61,48.82 SD_CARD.4
  Top 0.61: 71.63,46.92 C14.1 | R19.2 R21.2 R18.2 70.59,55.76 R20.2
N$28
  Top 0.254: IC1.5 17.21,13.07 15.78,11.63 R33.1
N$31
  Top 0.254: IC2.P$6 22.04,38.17 PWR.C
N$32
  Top 0.254: IC2.P$7 19.85,37.67 DONE.C
N$33
  Top 0.254: IC2.P$8 22.09,37.17 19.87,34.94 CHRG.C
N$34
  Top 0.254: CHRG.A R36.1
N$35
  Top 0.254: DONE.A 16.74,37.48 R37.1
N$36
  Top 0.254: PWR.A 17.23,40.17 R39.1
N$37
  Top 0.305: IC2.P$12 25.08,34.29 21.82,31.7 R43.2
N$38  (via drill 0.35)
  Top 0.254: IC2.P$13 25.58,32.72 24.63,31.77 v24,31.77 | R42.2 13.43,32.24 v17.45,32.24
  Bottom 0.254: v24,31.77 23.49,32.27 23.45,32.24 v17.45,32.24
N$39
  Top 0.254: U7.3 U7.2 13.84,61.43
  Top 0.305: U7.3 13.36,61.77
  Top 0.406: 14.15,61.43 13.84,61.43 13.7,61.43 13.36,61.77
  Top 0.508: 14.65,61.43 14.15,61.43
  Top 0.61: D1.C 16.69,62.49 C24.2
  Top 0.813: 14.65,61.43 15.21,61.43 C24.2
N$40  (via drill 0.35)
  Top 0.305: v22.41,39.39 22.66,39.13 IC2.P$5 | v16.06,45.42 16.06,46.79 16.51,47.24 16.51,48.5 R46.1
  Bottom 0.305: v22.41,39.39 22.09,39.39 18.91,42.56 17.01,42.56 16.06,43.52 v16.06,45.42
N$41
  Top 0.254: R48.2 14.05,53.03 13.65,52.63 RT1.2 13.69,51.35 13.69,49.94 14.39,49.24
  Top 0.305: R46.2 14.62,49.01 14.39,49.24
N$42
  Top 0.203: C18.1 58.1,73.27 57.15,74.23 57.15,75.18 57.45,75.48 Q6.6
  Top 0.305: C18.1 56.52,72.95 56.2,72.64 R26.1
N$43  (via drill 0.35)
  Top 0.508: CN1.VBUS 11.62,44.89 11.75,45.02
  Top 0.61: 11.75,45.02 12.06,45.33
  Top 0.813: 12.06,45.33 12.38,45.65 12.38,49.14 11.11,50.41 9.53,50.41 7.94,52 7.94,52.95 7.3,53.59 5.08,53.59 2.86,55.81 2.86,66.61 7.62,71.37 12.7,71.37 v14.61,69.46 | R32.1 24.21,67.56 v19.37,67.56
  Bottom 0.813: v19.37,67.56 16.51,67.56 v14.61,69.46
N$44
  Top 0.254: R34.1 22.84,13.25 22.02,14.07 IC1.8
  Top 0.508: R34.1 23.93,13.11 C25.2 23.45,10.73 R35.2
N$45
  Top 0.254: U7.9 10.79,61.43
  Top 0.305: 10.34,61.3 10.03,60.98 9.58,60.53 L2.2 8.88,61.3 9.71,61.3 10.34,61.3
  Top 0.406: 10.79,61.43 10.48,61.43 | 10.48,61.43 10.03,60.98 | 10.48,61.43 9.84,61.43 9.71,61.3
N$46
  Top 0.305: U7.5 13.52,63.25 13.52,63.52
  Top 0.508: R44.2 R45.2
  Top 0.61: 13.52,63.52 13.52,64.37 R45.2
N$47  (via drill 0.35)
  Top 0.203: Q6.1 60.63,75.48 v60.96,75.81 | R24.2 59.92,79.39 v60.33,78.99
  Bottom 0.203: v60.96,75.81 60.64,76.13 60.64,78.67 v60.33,78.99
N$48
  Top 0.203: 61.59,77.4 61.59,76.77 62.55,75.81 62.55,74.23 61.28,72.95 C18.2
  Top 0.254: Q6.3 60.02,76.78 60.33,77.08
  Top 0.406: 60.33,77.08 60.64,77.4
  Top 0.508: Q6.3 Q6.2 59.66,76.42 60.33,77.08 | RFM95W.13 72.81,79.2 72.07,79.94 65.09,79.94 64.77,79.62 64.77,78.03 64.14,77.4 C17.1
  Top 0.813: 60.64,77.4 60.65,77.4 61.59,77.4 C17.1
N$49  (via drill 0.35)
  Top 0.254: U7.7 10.79,62.43 v9.07,64.15 | v9.07,67.01 9.07,68.86 R47.1
  Bottom 0.254: v9.07,67.01 v9.07,64.15
N$50
  Top 0.203: U6.5 21.49,59.64
  Top 0.305: 21.49,59.64 21.49,59.96 21.14,60.31
  Top 0.508: 21.14,60.31 20.86,60.6
  Top 0.61: 20.86,60.6 20.52,60.93 R27.1 R28.2
N$51
  Top 0.203: U6.4 21.99,59.64
  Top 0.305: 21.99,59.64 21.99,59.89 22.38,60.28
  Top 0.508: 22.38,60.28 22.69,60.6
  Top 0.61: 22.69,60.6 22.69,61.5 | R29.1 R30.2
  Top 1.016: 22.69,61.5 R29.1
N$52
  Top 0.254: U6.10 21.49,56.22
  Top 0.305: 21.49,56.22 21.11,55.83
  Top 0.406: 21.11,55.83 20.79,55.52
  Top 0.508: 20.79,55.52 20.43,55.16 R31.2
N$53
  Top 0.254: U6.11 22.06,56.84 22.06,56.08
  Top 0.406: 22.06,56.08 22.06,55.52
  Top 0.508: 22.06,54.88 22.06,55.52
  Top 0.61: 22.06,54.88 22.06,53.93 21.11,52.98
  Top 0.813: C23.1 21.11,52.98
N$54
  Top 0.254: R38.2 25.58,40.61 IC2.P$3
N$55  (via drill 0.35)
  Top 0.813: D1.A 16.69,68.38 17.78,69.46 v31.11,69.46
  Bottom 0.813: v31.11,69.46 31.33,69.46 32.12,70.25 SOLAR.1
RFM_CS  (via drill 0.35)
  Top 0.305: S2MINI1.34 57.37,55.27 52.39,60.26 52.39,64.06 v54.61,66.29 | RFM95W.5 74.93,60.7 74.93,62.48 70.8,66.61 v56.98,66.61
  Bottom 0.305: v54.61,66.29 54.93,66.61 v56.98,66.61
RFM_DIO0  (via drill 0.35)
  Top 0.254: RFM95W.14 70.81,72.01 68.58,69.78 64.77,69.78 v63.18,68.19
  Bottom 0.254: S2MINI1.33 62.64,55.27 63.18,55.81 v63.18,68.19
RFM_DIO1
  Top 0.305: S2MINI1.38 57.37,60.35 55.88,61.84 55.88,69.46 57.47,71.05 66.99,71.05 68.81,72.87 RFM95W.15
RFM_PWR_EN  (via drill 0.35)
  Top 0.254: Q6.5 57.15,76.13 55.56,74.54 50.59,74.54 R25.2 49.55,74.56 47.2,72.2 47.2,66 v47.7,65.5 | S2MINI1.4 43.51,57.81 44.9,59.2 47.4,59.2 47.7,59.5 v47.7,63
  Bottom 0.254: v47.7,63 v47.7,65.5
RFM_RESET  (via drill 0.35)
  Top 0.305: v65.09,67.88 65.72,68.51 70.8,68.51 76.83,62.48 76.83,60.6 RFM95W.6
  Bottom 0.305: v65.09,67.88 65.09,54.86 62.96,52.73 S2MINI1.18
RTC_PWR_EN  (via drill 0.35)
  Top 0.254: U3.3 72.22,30.27 72.39,30.09 73.29,30.09 v73.6,30.4 | 58.42,44.18 58.42,44.08 59.2,43.3 v61.6,43.3 | v64.7,43.3 v70,43.3
  Top 0.305: S2MINI1.15 58.42,44.18
  Bottom 0.254: v61.6,43.3 v64.7,43.3 | v70,43.3 70.6,43.3 71.2,42.7 71.2,37.4 73.6,35 v73.6,30.4
SCK  (via drill 0.35)
  Top 0.254: v78.74,48.83 78.11,48.83 | 78.11,48.83 77.79,48.83 | 77.79,48.51 78.11,48.83 | 77.79,49.14 78.11,48.83 | v80.96,48.83 81.92,49.78 81.92,52 79.06,54.86 74.61,54.86 73.98,55.49 73.98,57.08 72.81,58.25 RFM95W.4
  Top 0.305: SD_CARD.5 77.31,47.72 77.79,48.19 77.79,48.51 77.79,48.83 77.79,49.14 77.79,51.68 76.2,53.27 72.61,53.27 R18.1 | S2MINI1.36 57.69,57.81 54.29,61.21 54.29,63.75 v54.61,64.06 | v56.83,64.38 57.78,65.34 70.17,65.34 72.81,62.7 RFM95W.4
  Bottom 0.254: v80.96,48.83 v78.74,48.83
  Bottom 0.305: v54.61,64.06 54.93,64.38 v56.83,64.38
SCL  (via drill 0.35)
  Top 0.254: I2C.3_A 71.12,12.63 72.07,13.58 73.03,13.58 73.88,14.43 R11.1 | 79.38,23.11 79.38,28.2 78.74,28.83 R12.1 78,28.93 v77.15,29.77 | S2MINI1.21 56.93,52.73 55.24,51.05 | 54.24,39.3 55.2,38.35 | v77.17,32.31 71.14,38.35 v64.77,38.35
  Top 0.305: 55.2,38.35 v61.59,38.35 | 55.24,51.05 54.1,49.9 v54.1,43.5 | v54.1,40.3 54.1,39.45 54.24,39.3
  Top 0.406: I2C.3_B 71.12,7.23 73.66,9.77 77.55,9.77 78.88,11.09 78.88,22.61 79.38,23.11 79.49,23.22 U4.8
  Bottom 0.254: I2C.3_A I2C.3_B | v77.17,32.31 77.15,32.3 v77.15,29.77
  Bottom 0.305: v61.59,38.35 v64.77,38.35 | v54.1,43.5 v54.1,40.3
SD_CS  (via drill 0.35)
  Top 0.254: S2MINI1.16 63.91,50.19 v66.04,52.32 | v73.66,52.32 73.98,52 73.98,51.33 | 73.98,51.33 73.98,51.02 | 73.66,51.02 73.98,51.33 | 73.98,51.33 74.3,51.02
  Top 0.305: R21.1 72.39,51.37 72.74,51.02 73.66,51.02 73.98,51.02 74.3,51.02 SD_CARD.2
  Bottom 0.254: v66.04,52.32 v73.66,52.32
SD_PWR_EN  (via drill 0.35)
  Top 0.254: v44.13,40.25 44.13,49.46 43.4,50.19 S2MINI1.10 | v44.63,37.51 49.89,37.51 59,28.4 v62.8,28.4 | Q5.5 65.16,30.74 v65.2,30.7 | v47.1,39.9 47.23,39.9 R16.2
  Bottom 0.254: v44.63,37.51 44.63,39.75 v44.13,40.25 46.75,40.25 v47.1,39.9 | v62.8,28.4 65.1,30.7 v65.2,30.7
SDA  (via drill 0.35)
  Top 0.254: I2C.4_A 73.66,12.31 75.42,14.07 75.42,16.89 74.6,17.71 R13.1 | S2MINI1.17 57.24,50.19 56.52,49.46 | U4.7 83.94,21.95 84.45,22.47 84.45,24.38 84.14,24.7 81.92,24.7 81.28,25.33 R14.1 82.65,28.93 83.19,29.46 83.19,32.31 82.57,32.93 78.27,32.93 71.58,39.62 v64.77,39.62 | v61.59,39.62 56.15,39.62 v55.52,40.25
  Top 0.305: 56.52,49.46 55.5,48.45 v55.5,43.6
  Top 0.406: I2C.4_B 73.66,7.55 74.69,8.58 77.39,8.58 79.71,10.91 79.71,20.9 80.76,21.95 U4.7
  Bottom 0.254: I2C.4_A I2C.4_B | v64.77,39.62 v61.59,39.62
  Bottom 0.305: v55.5,43.6 55.5,40.27 v55.52,40.25
SDI12_DATA  (via drill 0.35)
  Top 0.254: S2MINI1.14 40.64,43.66 41.5,42.8 41.5,42.1 | 41.5,42.1 41.5,41.6 | 41.5,41.6 v41.5,40.1 | v41.7,37.1 41.7,36.3 42.7,35.3 49.1,35.3 53.5,30.9 | R3.1 41.2,41.8 | 41.2,41.8 41.5,42.1 | 41.5,41.6 41.3,41.8 41.2,41.8
  Top 0.305: 53.5,30.9 56.3,28.1 56.3,26.1 60,22.4 61.25,22.4 61.95,21.7 Q1.2
  Bottom 0.254: v41.5,40.1 41.5,37.3 v41.7,37.1
SDI12_PWR_EN  (via drill 0.35)
  Top 0.254: U2.3 55.9,18.01 55.24,18.66 55.24,24.38 54.5,25.12 R6.2 48.51,25.96 | 48.51,25.96 48.51,26.35 47.94,26.92 v46.35,26.92 | 48.51,25.96 48.58,25.89 v48.58,23.11 | S2MINI1.9 37.24,52.73 36.2,51.68 36.2,37.71 v36.4,37.5 | v38.7,35.2 39.6,34.3 44.37,34.3 v45.72,32.95 | v49.21,21.2 49.41,21 50.45,21 Q3.5
  Bottom 0.254: v45.72,32.95 45.72,27.23 46.04,26.92 v46.35,26.92 | v36.4,37.5 v38.7,35.2
  Bottom 0.305: v49.21,21.2 48.58,21.84 v48.58,23.11
SM_ADC
  Top 0.254: SOIL_MOISTURE.2_A 20.64,73.59 20.97,73.92 36.18,73.92 40.64,69.46 40.64,67.69 40.41,67.47 C3.1 40.64,66.89 S2MINI1.1
  Bottom 0.254: SOIL_MOISTURE.2_B SOIL_MOISTURE.2_A
ST_DATA
  Top 0.254: SOIL_TEMP.2_B SOIL_TEMP.2_A 12.66,75.05 37.91,75.05 42.55,70.42 42.55,61.53 | S2MINI1.2 41.37,60.35 42.23,61.21 | 42.55,61.53 42.23,61.21 | R1.1 43.27,60.8 42.86,61.21 | 42.86,61.21 42.55,61.53 | 42.23,61.21 42.86,61.21
VCC
  Top 0.254: 14.95,33.36 19.87,33.36 23.18,36.67 IC2.P$9 | U6.8 21.32,57.71 U6.8_1 | U6.1 22.39,57.68 U6.1_1 | IC2.P$4 25.08,39.89 24.63,40.34 24,40.34 | IC2.P$17 IC2.P$18 | IC2.P$17 27.55,36.77 27.94,37.17 | IC2.P$17 28.16,36.67 28.26,36.76 28.26,37.03 28.12,37.17
  Top 0.305: IC2.P$19 27.73,37.48 28.12,37.48 | 28.12,37.48 28.44,37.48 28.12,37.17 | IC2.P$19 IC2.P$18 | IC2.P$19 27.94,37.67 28.12,37.48 | 14.95,33.36 14.26,34.05 R36.2
  Top 0.406: IC2.P$18 27.94,37.17 28.12,37.17 | U6.1 23.04,57.71 23.65,57.1 | U6.8 22.12,57.71 U6.1_1 | 24,40.34 23.36,40.34
  Top 0.508: R36.2 R37.2 R39.2 14.11,42.52 15.11,43.52 16.69,43.52 17.64,44.47 17.64,46.37 21.14,49.87 22.09,49.87
  Top 0.61: 23.65,57.1 24.6,56.15 | 23.36,40.34 22.73,40.34 22.09,40.98
  Top 0.813: 22.09,40.98 21.5,41.56 C29.1 21.5,45.79 22.36,46.64 R40.2 22.09,47.91 22.09,49.87 24.6,52.37 24.6,56.15 27.29,53.46 29.66,53.46 32.37,50.75 32.37,43.63 30.84,42.11 31.11,41.84 31.11,40.57 | 30.45,41.72 30.45,41.23 31.11,40.57 | 31.11,40.57 31.11,38.25 30.69,37.82
  Top 1.016: 28.12,37.17 30.03,37.17 30.69,37.82
  Top 1.27: 30.84,42.11 30.45,41.72 C27.1
VCC2  (via drill 0.35)
  Top 0.305: IC2.P$20 27.85,38.17 28.12,38.44 | 28.12,38.44 28.12,38.75 v27.8,39.07 27.8,38.42 IC2.P$20 | 28.12,38.44 27.75,38.81 27.75,39.13 | IC2.P$1 IC2.P$20
  Top 0.508: 27.17,39.39 26.84,39.39
  Top 0.61: 27.17,39.39 27.49,39.39 27.75,39.13 | 26.84,39.39 27.8,38.42
  Top 0.813: 27.75,39.13 v27.8,39.07
  Top 1.016: v29.07,33.36 29.07,31.34 22.22,24.49 C32.1 10.09,24.49 7.63,22.03 S1.1
  Bottom 1.016: v27.8,39.07 28.12,39.07 29.07,38.12 v29.07,33.36
VCC_SW
  Top 0.254: IC1.3 17.26,14.07 16.95,14.39
  Top 0.305: IC1.2 17.13,14.57 16.95,14.39
  Top 0.508: 34.61,12.11 34.63,12.1 35.9,12.1 | 35.9,12.1 35.48,11.68 35.05,11.68 | U9.5 37.3,12.5 36.3,12.5 | 36.3,12.5 35.9,12.1 | 36.3,12.5 34.23,12.5 34.1,12.63
  Top 0.61: 16.63,14.39 16.95,14.39
  Top 0.813: U8.5 38.52,29.14 39.19,29.81 U8.4 | 31.11,13.26 31.11,14.22 33.45,16.56 33.45,27.99 34.29,28.82 C34.1 | 15.99,14.39 16.63,14.39 | U9.4 37.63,12.83 37.3,12.5
  Top 1.016: 35.05,11.68 34.61,12.11 34.1,12.63 C35.1 31.75,12.63 | 31.11,12.63 31.75,12.63 | 31.11,13.26 31.75,12.63 | L3.1 37.8,25.11 37.8,28.17 | C34.1 37.15,28.82 | 37.8,28.17 37.15,28.82 | 37.8,28.17 37.8,28.42 38.2,28.82 | 38.2,28.82 39.19,29.81 | 37.15,28.82 38.2,28.82
  Top 1.27: 31.11,12.63 29.84,11.36 29.84,6.82 27.7,4.68 13.1,4.68 10.9,6.88 10.9,13.19 9.7,14.39 | 9.7,14.39 8.37,14.39 S1.2 | 9.7,14.39 C21.1 C20.1 15.99,14.39 | L4.1 36.27,8.83 35.05,10.05 35.05,11.68
VIN1
  Top 0.254: U7.8 10.34,61.93 10.03,62.25 7.17,62.25
  Top 0.305: R44.1 11.08,66.69 10.45,66.06 7.8,66.06 7.17,65.42 7.17,64.47 4.95,62.25 | 7.17,62.25 4.95,62.25 | 4.95,62.25 4.63,61.93 4.63,56.22 5.58,55.26 7.17,55.26 8.12,56.22 L2.1 | U7.10 11.29,60.34 | C31.2 11.3,58.34 11.46,57.34
  Top 0.406: U7.10 | U6.7_1 U6.7 19.84,58.41
  Top 0.508: 11.29,60.34 11.29,60.03 | R44.1 11.71,68.53 R47.2
  Top 0.61: 11.29,60.03 11.29,59.32
  Top 0.813: 17.65,58.41 17.65,59.36 18.25,59.96 18.25,61.35 R27.2 | 11.58,57.76 C31.2 11.29,59.31 11.29,59.32 | 19.84,58.41 18.28,58.41
  Top 1.016: 11.58,57.76 11.03,57.21 8.52,57.21 L2.1 | 11.46,57.34 12.53,56.27 15.61,56.27 17.75,58.41 | 18.28,58.41 17.75,58.41 | 17.75,58.41 17.65,58.41
VIN2
  Top 0.406: U6.2_1 U6.2 23.33,58.41
  Top 0.61: 23.33,58.41 24.95,58.41
  Top 0.813: 24.95,58.41 25.23,58.69
  Top 1.27: R32.2 26.82,66.99 26.82,61.87 26.5,61.55 | 26.5,61.55 R29.2 | 26.5,61.55 25.87,60.91 25.87,59.33 25.23,58.69
VPCC
  Top 0.254: 26.08,46.24 IC2.P$2
  Top 0.305: R41.1 25.27,50.18 24.36,49.28 R40.1 24.68,47.64 26.08,46.24

## Text on the board
tNames: - | D | + | + | D | - | RFM95W | ON | OFF | + | D | - | + | SCL | SDA | - | + | D | - | HP
bNames: GITHUB | WILO V2.0 | IMPACT - STELLENBOSCH UNIVERSITY | DESIGNED BY CS ERASMUS